# EAGLE design single_motor_improved (EAGLE 7.5.0)
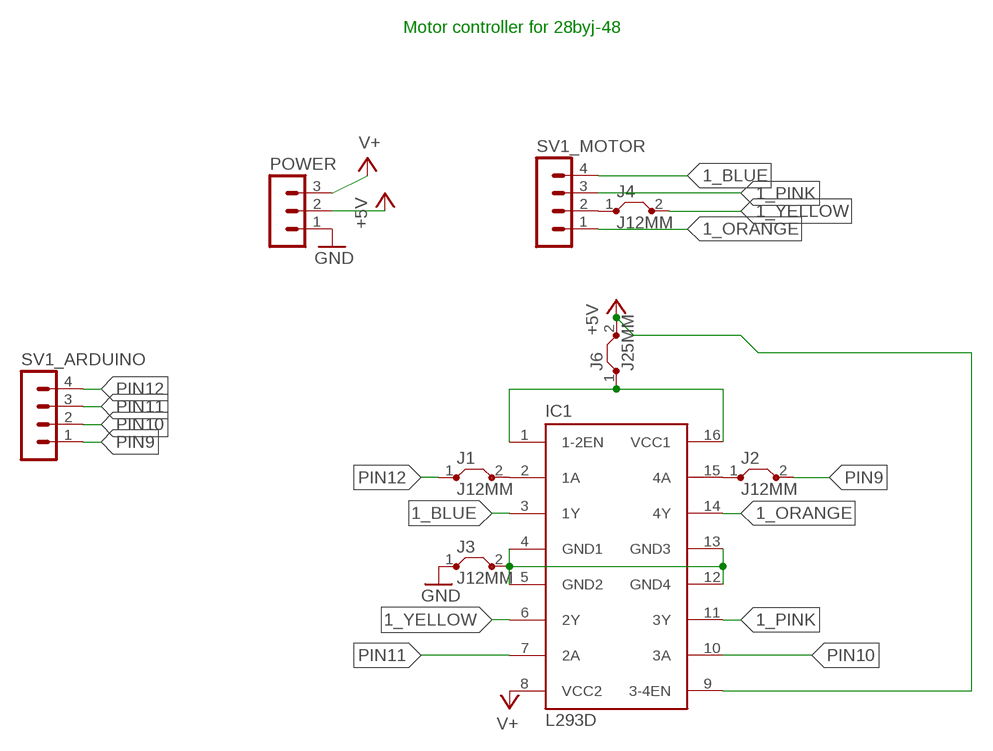
[diagram p0: schematic, sheet 1]

## Parts
IC1  L293D  [DIL16]
J1  J12MM  [12]
J2  J12MM  [12]
J3  J12MM  [12]
J4  J12MM  [12]
J6  J25MM  [25]
POWER  MA03-1  [MA03-1]
SV1_ARDUINO  MA04-1  [MA04-1]
SV1_MOTOR  MA04-1  [MA04-1]

## Nets
1_BLUE: IC1.3(1Y) SV1_MOTOR.4
1_ORANGE: IC1.14(4Y) SV1_MOTOR.1
1_PINK: IC1.11(3Y) SV1_MOTOR.3
1_YELLOW: IC1.6(2Y) J4.2
+5V: IC1.9(3-4EN) J6.2 POWER.2
GND: J3.1 POWER.1
N$1: IC1.2(1A) J1.2
N$2: IC1.15(4A) J2.1
N$3: IC1.1(1-2EN) IC1.16(VCC1) J6.1
N$7: J4.1 SV1_MOTOR.2
N$11: IC1.4(GND1) IC1.5(GND2) IC1.12(GND4) IC1.13(GND3) J3.2
PIN9: J2.2 SV1_ARDUINO.1
PIN10: IC1.10(3A) SV1_ARDUINO.2
PIN11: IC1.7(2A) SV1_ARDUINO.3
PIN12: J1.1 SV1_ARDUINO.4
V+: IC1.8(VCC2) POWER.3

## Notes on the sheet
- Motor controller for 28byj-48

## Library data of the parts
IC1 = st-microelectronics:L293D: PUSH-PULL 4 CHANNEL DRIVER; MPN: L293D; OC_FARNELL: 9589619; OC_NEWARK: 56P8249
J1-J4 J6 = jumper:J: Bridge
POWER = con-lstb:MA03-1: PIN HEADER; OC_FARNELL: unknown; OC_NEWARK: unknown
SV1_ARDUINO SV1_MOTOR = con-lstb:MA04-1: PIN HEADER; OC_FARNELL: unknown; OC_NEWARK: unknown

## Board
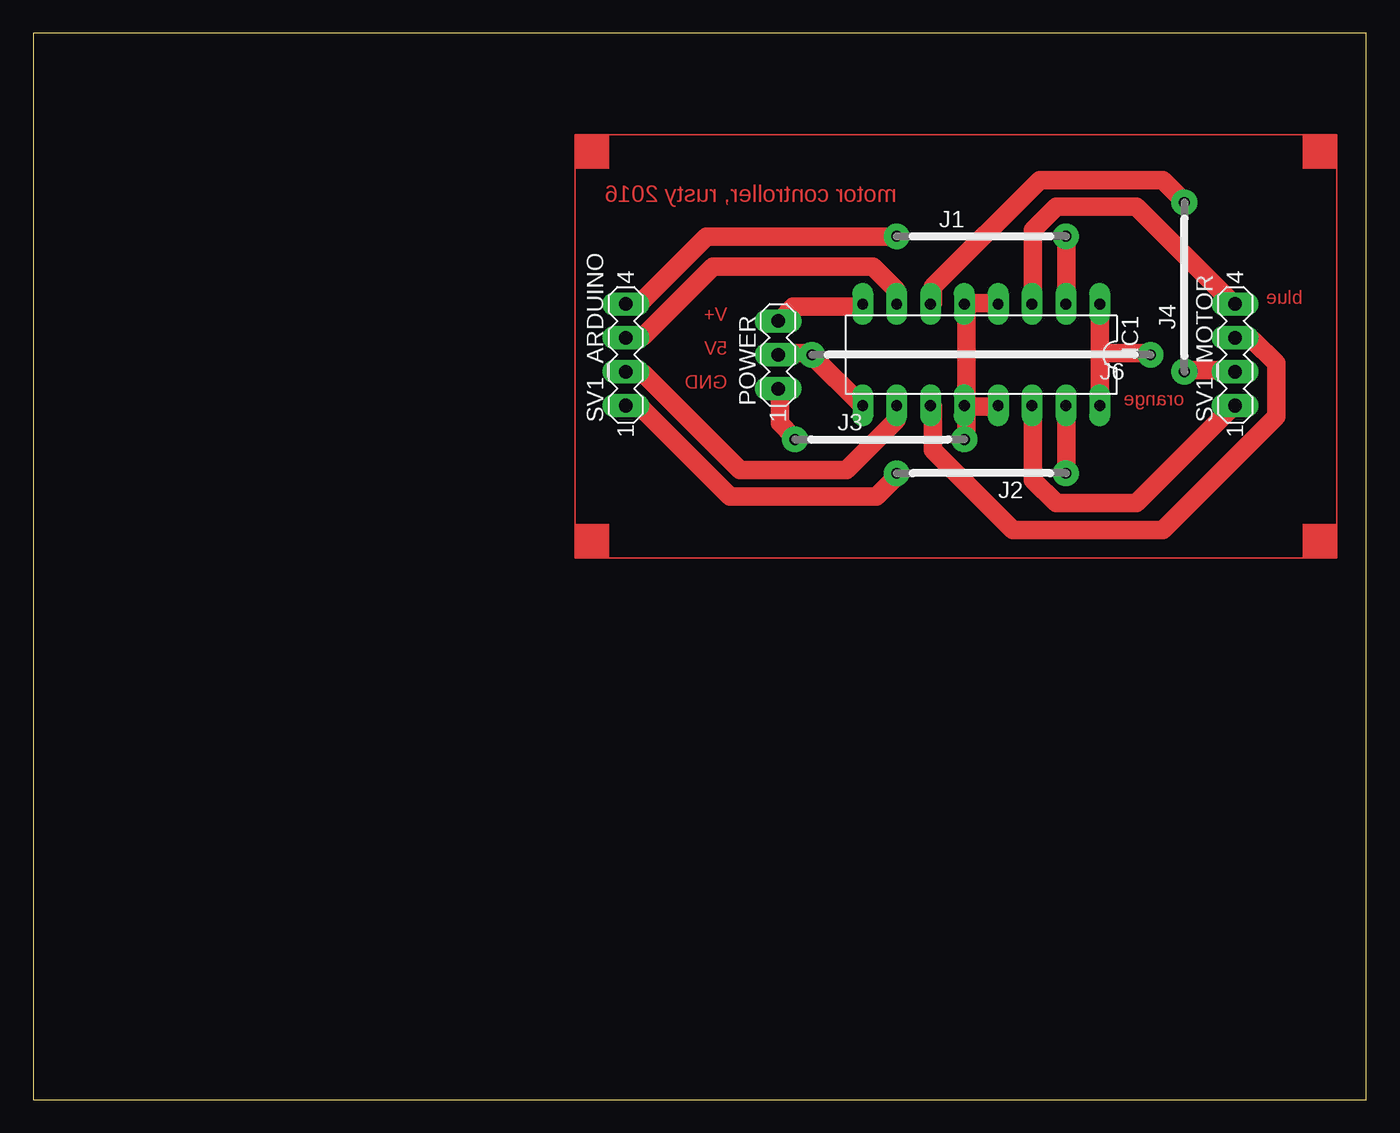
[diagram p1: board, top side]

Size 100 x 80 mm. Coordinates in mm from the lower left corner, seen from the top.
Outline: 0,0 100,0 100,80 0,80 0,0
Copper layers (1*16): Top 0.035mm / dielectric 1.5mm / Bottom 0.035mm
Design rules "default *": minimum track width 55mil, minimum drill 24mil, track to track 15mil, track to pad 15mil, pad to pad 15mil, via to via 15mil, smd to smd 15mil, copper to edge 40mil, drill to drill 8mil, minimum pad ring 15mil, minimum via ring 15mil, stop-mask expansion 4mil, vias tented up to drill 0mil, thermal gap 10mil

### Footprints (pad centres in the part's own frame; a part is rotated, then mirrored left to right if it is on the bottom)
DIL16 = drill 0.813 long: 1 -8.89,-3.81; 2 -6.35,-3.81; 3 -3.81,-3.81; 4 -1.27,-3.81; 5 1.27,-3.81; 6 3.81,-3.81; 7 6.35,-3.81; 8 8.89,-3.81; 9 8.89,3.81; 10 6.35,3.81; 11 3.81,3.81; 12 1.27,3.81; 13 -1.27,3.81; 14 -3.81,3.81; 15 -6.35,3.81; 16 -8.89,3.81
12 = drill 0.813 pad 1.93: 1 -6.35,0; 2 6.35,0
25 = drill 0.813 pad 1.93: 1 -12.7,0; 2 12.7,0
MA03-1 = drill 1.016 long: 1 -2.54,0; 2 0,0; 3 2.54,0
MA04-1 = drill 1.016 long: 1 -3.81,0; 2 -1.27,0; 3 1.27,0; 4 3.81,0

### Placement (x,y rotation side)
IC1  71.12,55.88 180 top
J1  71.12,64.77 0 top
J2  71.12,46.99 180 top
J3  63.5,49.53 0 top
J4  86.36,60.96 90 top
J6  71.12,55.88 180 top
POWER  55.88,55.88 90 top
SV1_ARDUINO  44.45,55.88 90 top
SV1_MOTOR  90.17,55.88 90 top

### Tracks (layer width: path | path; a pad name or v marks a point on that pad's centre or on a via)
1_BLUE
  Top 1.397: IC1.3 75,59.75 75,65.25 76.75,67 82.75,67 90,59.75 SV1_MOTOR.4
1_ORANGE
  Top 1.397: IC1.14 75,52 75,46.5 76.75,44.75 82.75,44.75 90,52 SV1_MOTOR.1
1_PINK
  Top 1.397: IC1.11 67.5,52 67.5,48.75 73.5,42.75 84.75,42.75 93.25,51.25 93.25,55.25 91.5,57 90.25,57 SV1_MOTOR.3
1_YELLOW
  Top 1.397: IC1.6 67.5,59.75 67.5,61 75.5,69 84.75,69 86.25,67.5 J4.2
+5V
  Top 1.397: IC1.9 62,52.25 58.5,55.75 J6.2 57.75,56 56,56 POWER.2
GND
  Top 1.397: POWER.1 56,53.25 56,50.75 57,49.75 J3.1
N$1
  Top 1.397: IC1.2 77.5,59.75 77.5,64.75 J1.2
N$2
  Top 1.397: IC1.15 77.5,52 77.5,47 J2.1
N$3
  Top 1.397: 80,56 80,59.5 IC1.1 | 80,56 80,52.25 IC1.16 | 80,56 83.75,56 J6.1
N$7
  Top 1.397: SV1_MOTOR.2 90,54.75 86.5,54.75 J4.1
N$11
  Top 1.397: IC1.4 72.25,59.75 70,59.75 IC1.5 70,59 70,52.75 IC1.12 | IC1.12 70,52 72.25,52 IC1.13 | J3.2 70,49.75 70,51.5 IC1.12
PIN9
  Top 1.397: SV1_ARDUINO.1 44.5,52 45.5,52 52.25,45.25 63.25,45.25 64.75,46.75 J2.2
PIN10
  Top 1.397: IC1.10 64.75,52 64.75,51 61,47.25 53,47.25 45.75,54.5 44.5,54.5 SV1_ARDUINO.2
PIN11
  Top 1.397: IC1.7 64.75,59.75 64.75,60.75 63,62.5 51,62.5 45.75,57.25 44.5,57.25 SV1_ARDUINO.3
PIN12
  Top 1.397: SV1_ARDUINO.4 44.5,59.75 45.5,59.75 50.5,64.75 64.75,64.75 J1.1
V+
  Top 1.397: IC1.8 62,59.5 57,59.5 56,58.5 POWER.3
(copper drawn outside any net)
  shapes: Top area x5

### Text on the board
Top: motor controller, rusty 2016 | blue | V+ | 5V | GND | orange